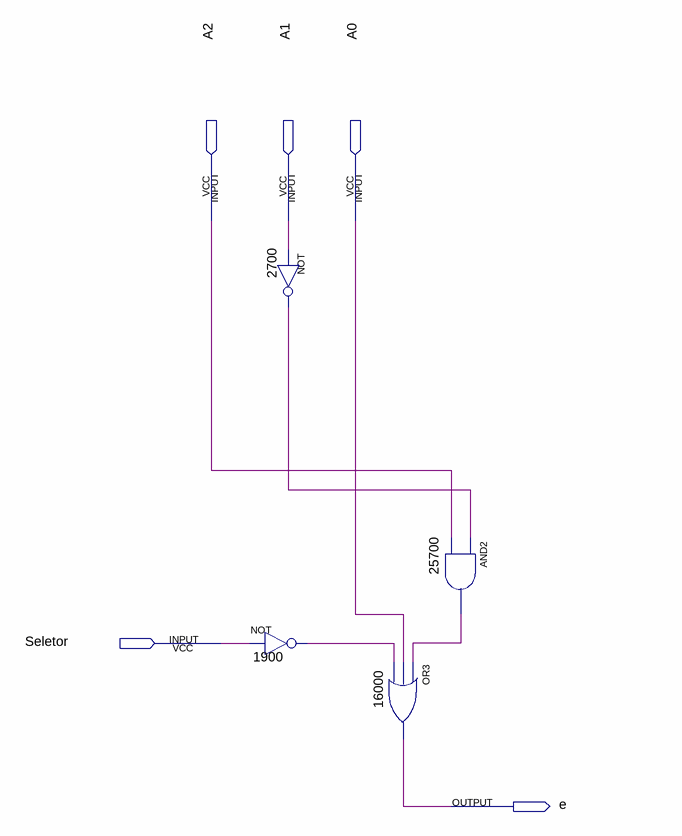
[diagram p0: schematic sheet]
// Quartus schematic segmento_e.bdf as structural Verilog: 4 symbols, 5 pins
module segmento_e (
  input  A2,
  input  A1,
  input  A0,
  input  Seletor,
  output e
);

  wire n1900_out, n2700_out, n25700_out;

  not u_2700 (n2700_out, A1);
  not u_1900 (n1900_out, Seletor);
  and u_25700 (n25700_out, n2700_out, A2);
  or u_16000 (e, n25700_out, A0, n1900_out);
endmodule
